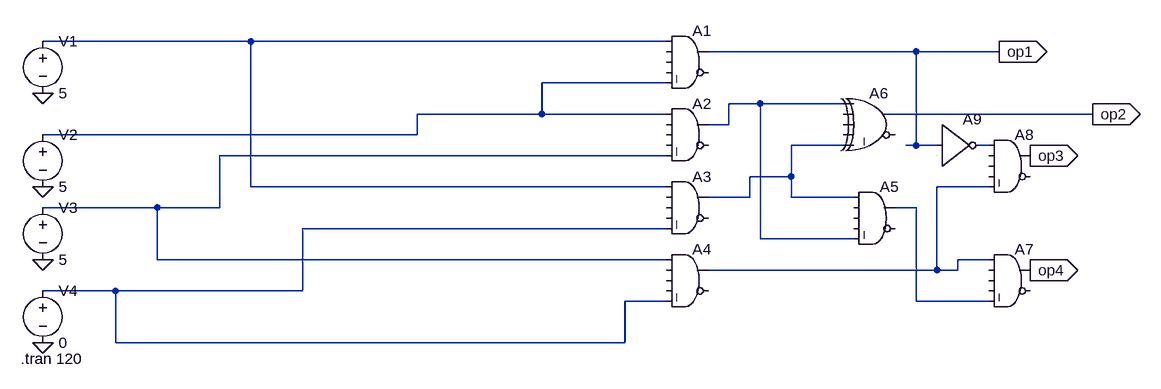
[diagram p0: schematic (21)2 bit multipier.asc]
(21)2 bit multipier.asc, the LTspice schematic file:
Version 4
SHEET 1 888 680
WIRE -512 64 -832 64
WIRE 128 64 -512 64
WIRE 512 80 192 80
WIRE 640 80 512 80
WIRE 128 128 -64 128
WIRE 272 160 224 160
WIRE 400 160 272 160
WIRE -64 176 -64 128
WIRE -64 176 -256 176
WIRE 128 176 -64 176
WIRE 784 176 464 176
WIRE 224 192 224 160
WIRE 224 192 192 192
WIRE -256 208 -256 176
WIRE -256 208 -832 208
WIRE 400 224 320 224
WIRE 512 224 512 80
WIRE 512 224 496 224
WIRE 544 224 512 224
WIRE 624 224 608 224
WIRE 128 240 -560 240
WIRE 320 272 320 224
WIRE 320 272 256 272
WIRE -512 288 -512 64
WIRE 128 288 -512 288
WIRE 624 288 544 288
WIRE 256 304 256 272
WIRE 256 304 192 304
WIRE 320 304 320 272
WIRE 416 304 320 304
WIRE -656 320 -832 320
WIRE -560 320 -560 240
WIRE -560 320 -656 320
WIRE 512 320 480 320
WIRE 128 352 -432 352
WIRE 272 368 272 160
WIRE 416 368 272 368
WIRE -656 400 -656 320
WIRE 128 400 -656 400
WIRE 624 400 576 400
WIRE 544 416 544 288
WIRE 544 416 192 416
WIRE 576 416 576 400
WIRE 576 416 544 416
WIRE -720 448 -832 448
WIRE -432 448 -432 352
WIRE -432 448 -720 448
WIRE 128 464 64 464
WIRE 512 464 512 320
WIRE 624 464 512 464
WIRE -720 528 -720 448
WIRE 64 528 64 464
WIRE 64 528 -720 528
FLAG -832 144 0
FLAG -832 288 0
FLAG -832 400 0
FLAG -832 528 0
FLAG 640 80 op1
IOPIN 640 80 Out
FLAG 784 176 op2
IOPIN 784 176 Out
FLAG 688 240 op3
IOPIN 688 240 Out
FLAG 688 416 op4
IOPIN 688 416 Out
SYMBOL Digital\\and 160 32 R0
SYMATTR InstName A1
SYMBOL Digital\\and 160 144 R0
SYMATTR InstName A2
SYMBOL Digital\\and 160 256 R0
SYMATTR InstName A3
SYMBOL Digital\\and 160 368 R0
SYMATTR InstName A4
SYMBOL Digital\\and 448 272 R0
SYMATTR InstName A5
SYMBOL Digital\\xor 448 128 R0
SYMATTR InstName A6
SYMBOL Digital\\and 656 368 R0
SYMATTR InstName A7
SYMBOL Digital\\and 656 192 R0
SYMATTR InstName A8
SYMBOL Digital\\inv 544 160 R0
SYMATTR InstName A9
SYMBOL voltage -832 48 R0
WINDOW 123 0 0 Left 0
WINDOW 39 0 0 Left 0
SYMATTR InstName V1
SYMATTR Value 5
SYMBOL voltage -832 192 R0
WINDOW 123 0 0 Left 0
WINDOW 39 0 0 Left 0
SYMATTR InstName V2
SYMATTR Value 5
SYMBOL voltage -832 304 R0
WINDOW 123 0 0 Left 0
WINDOW 39 0 0 Left 0
SYMATTR InstName V3
SYMATTR Value 5
SYMBOL voltage -832 432 R0
WINDOW 123 0 0 Left 0
WINDOW 39 0 0 Left 0
SYMATTR InstName V4
SYMATTR Value 0
TEXT -866 552 Left 2 !.tran 120

The netlist it stands for:
* (21)2 bit multipier.asc
A1 N001 0 0 0 N002 0 op1 0 AND
A2 N002 0 0 0 N006 0 N003 0 AND
A3 N001 0 0 0 N009 0 N004 0 AND
A4 N006 0 0 0 N009 0 N007 0 AND
A5 N004 0 0 0 N003 0 N008 0 AND
A6 N003 0 0 0 N004 0 op2 0 XOR
A7 N007 0 0 0 N008 0 op4 0 AND
A8 N005 0 0 0 N007 0 op3 0 AND
A9 op1 0 0 0 0 N005 0 0 BUF
V1 N001 0 5
V2 N002 0 5
V3 N006 0 5
V4 N009 0 0
.tran 120
.backanno
.end